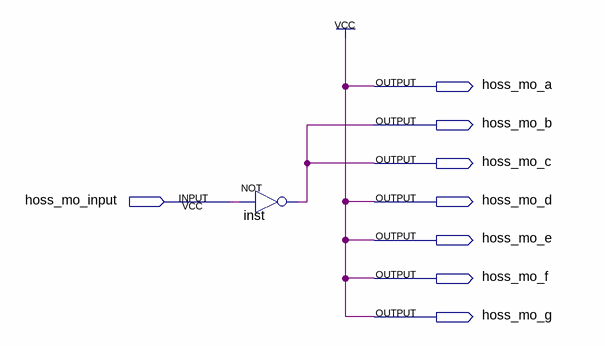
[diagram p0: schematic sheet]
// Quartus schematic supCircuitB.bdf as structural Verilog: 1 symbols, 8 pins
module supCircuitB (
  input  hoss_mo_input,
  output hoss_mo_a,
  output hoss_mo_b,
  output hoss_mo_c,
  output hoss_mo_d,
  output hoss_mo_e,
  output hoss_mo_f,
  output hoss_mo_g
);

  not inst (hoss_mo_b, hoss_mo_input);

  assign hoss_mo_a = 1'b1;
  assign hoss_mo_c = hoss_mo_b;
  assign hoss_mo_d = 1'b1;
  assign hoss_mo_e = 1'b1;
  assign hoss_mo_f = 1'b1;
  assign hoss_mo_g = 1'b1;
endmodule
